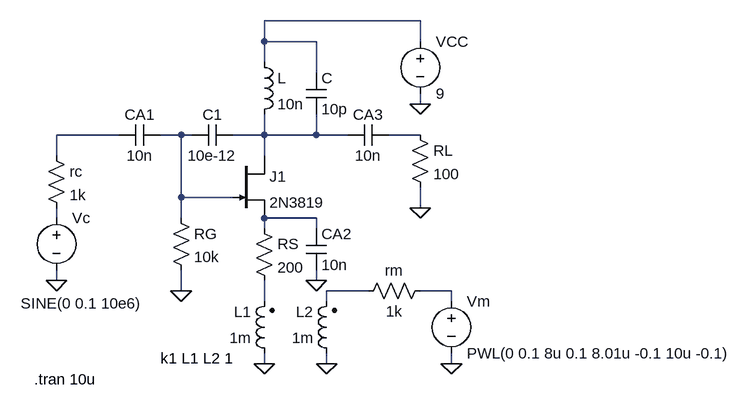
[diagram p0: schematic armstrong2n3819.asc]
armstrong2n3819.asc, the LTspice schematic file:
Version 4
SHEET 1 928 680
WIRE 416 -96 176 -96
WIRE 176 -64 176 -96
WIRE 256 -64 176 -64
WIRE 416 -64 416 -96
WIRE 176 -32 176 -64
WIRE 256 -16 256 -64
WIRE 416 32 416 16
WIRE -48 80 -144 80
WIRE 48 80 16 80
WIRE 64 80 48 80
WIRE 176 80 176 48
WIRE 176 80 128 80
WIRE 256 80 256 48
WIRE 256 80 176 80
WIRE 304 80 256 80
WIRE 416 80 368 80
WIRE -144 112 -144 80
WIRE 176 112 176 80
WIRE 48 176 48 80
WIRE 128 176 48 176
WIRE 416 192 416 160
WIRE -144 208 -144 192
WIRE 48 208 48 176
WIRE 256 208 176 208
WIRE 176 224 176 208
WIRE 256 224 256 208
WIRE -144 304 -144 288
WIRE 256 304 256 288
WIRE 48 320 48 288
WIRE 336 320 272 320
WIRE 464 320 416 320
WIRE 176 336 176 304
WIRE 272 336 272 320
WIRE 464 336 464 320
WIRE 176 432 176 416
WIRE 272 432 272 416
WIRE 464 432 464 416
FLAG 176 432 0
FLAG 272 432 0
FLAG 464 432 0
FLAG 256 304 0
FLAG 48 320 0
FLAG 416 192 0
FLAG 416 32 0
FLAG -144 304 0
SYMBOL njf 128 112 R0
SYMATTR InstName J1
SYMATTR Value 2N3819
SYMBOL res 160 208 R0
SYMATTR InstName RS
SYMATTR Value 200
SYMBOL ind2 192 432 R180
WINDOW 0 36 80 Left 2
WINDOW 3 36 40 Left 2
SYMATTR InstName L1
SYMATTR Value 1m
SYMATTR Type ind
SYMBOL ind2 288 432 R180
WINDOW 0 36 80 Left 2
WINDOW 3 36 40 Left 2
SYMATTR InstName L2
SYMATTR Value 1m
SYMATTR Type ind
SYMBOL res 432 304 R90
WINDOW 0 0 56 VBottom 2
WINDOW 3 32 56 VTop 2
SYMATTR InstName rm
SYMATTR Value 1k
SYMBOL voltage 464 320 R0
WINDOW 123 0 0 Left 0
WINDOW 39 0 0 Left 0
SYMATTR InstName Vm
SYMATTR Value PWL(0 0.1 8u 0.1 8.01u -0.1 10u -0.1)
SYMBOL cap 240 224 R0
SYMATTR InstName CA2
SYMATTR Value 10n
SYMBOL res 32 192 R0
SYMATTR InstName RG
SYMATTR Value 10k
SYMBOL cap 128 64 R90
WINDOW 0 0 32 VBottom 2
WINDOW 3 32 32 VTop 2
SYMATTR InstName C1
SYMATTR Value 10e-12
SYMBOL cap 16 64 R90
WINDOW 0 0 32 VBottom 2
WINDOW 3 32 32 VTop 2
SYMATTR InstName CA1
SYMATTR Value 10n
SYMBOL ind 160 -48 R0
SYMATTR InstName L
SYMATTR Value 10n
SYMBOL cap 240 -16 R0
SYMATTR InstName C
SYMATTR Value 10p
SYMBOL cap 368 64 R90
WINDOW 0 0 32 VBottom 2
WINDOW 3 32 32 VTop 2
SYMATTR InstName CA3
SYMATTR Value 10n
SYMBOL res 400 64 R0
SYMATTR InstName RL
SYMATTR Value 100
SYMBOL voltage 416 -80 R0
WINDOW 123 0 0 Left 0
WINDOW 39 0 0 Left 0
SYMATTR InstName VCC
SYMATTR Value 9
SYMBOL voltage -144 192 R0
WINDOW 3 -55 147 Left 2
WINDOW 123 0 0 Left 0
WINDOW 39 0 0 Left 0
SYMATTR InstName Vc
SYMATTR Value SINE(0 0.1 10e6)
SYMBOL res -160 96 R0
SYMATTR InstName rc
SYMATTR Value 1k
TEXT 16 424 Left 2 !k1 L1 L2 1
TEXT -178 456 Left 2 !.tran 10u

The netlist it stands for:
* armstrong2n3819.asc
J1 N004 N003 N007 2N3819
RS N007 N010 200
L1 0 N010 1m
L2 0 N008 1m
rm N009 N008 1k
Vm N009 0 PWL(0 0.1 8u 0.1 8.01u -0.1 10u -0.1)
CA2 N007 0 10n
RG N003 0 10k
C1 N004 N003 10e-12
CA1 N003 N002 10n
L N001 N004 10n
C N001 N004 10p
CA3 N005 N004 10n
RL N005 0 100
VCC N001 0 9
Vc N006 0 SINE(0 0.1 10e6)
rc N002 N006 1k
.model NJF NJF
.model PJF PJF
.lib standard.jft
k1 L1 L2 1
.tran 10u
.backanno
.end